# EasyEDA Pro project InOut Counter - Copy (2).eprj

# Schematic MainBoard
Board Name: PCB2; Create Date: 2026-01-17; Page Name: P1; Project Name: InOut Counter - Copy (2); Schematic Name: MainBoard; Update Date: 2026-01-26; Company: EasyEDA.com; Page Size: A4; Version: V1.0
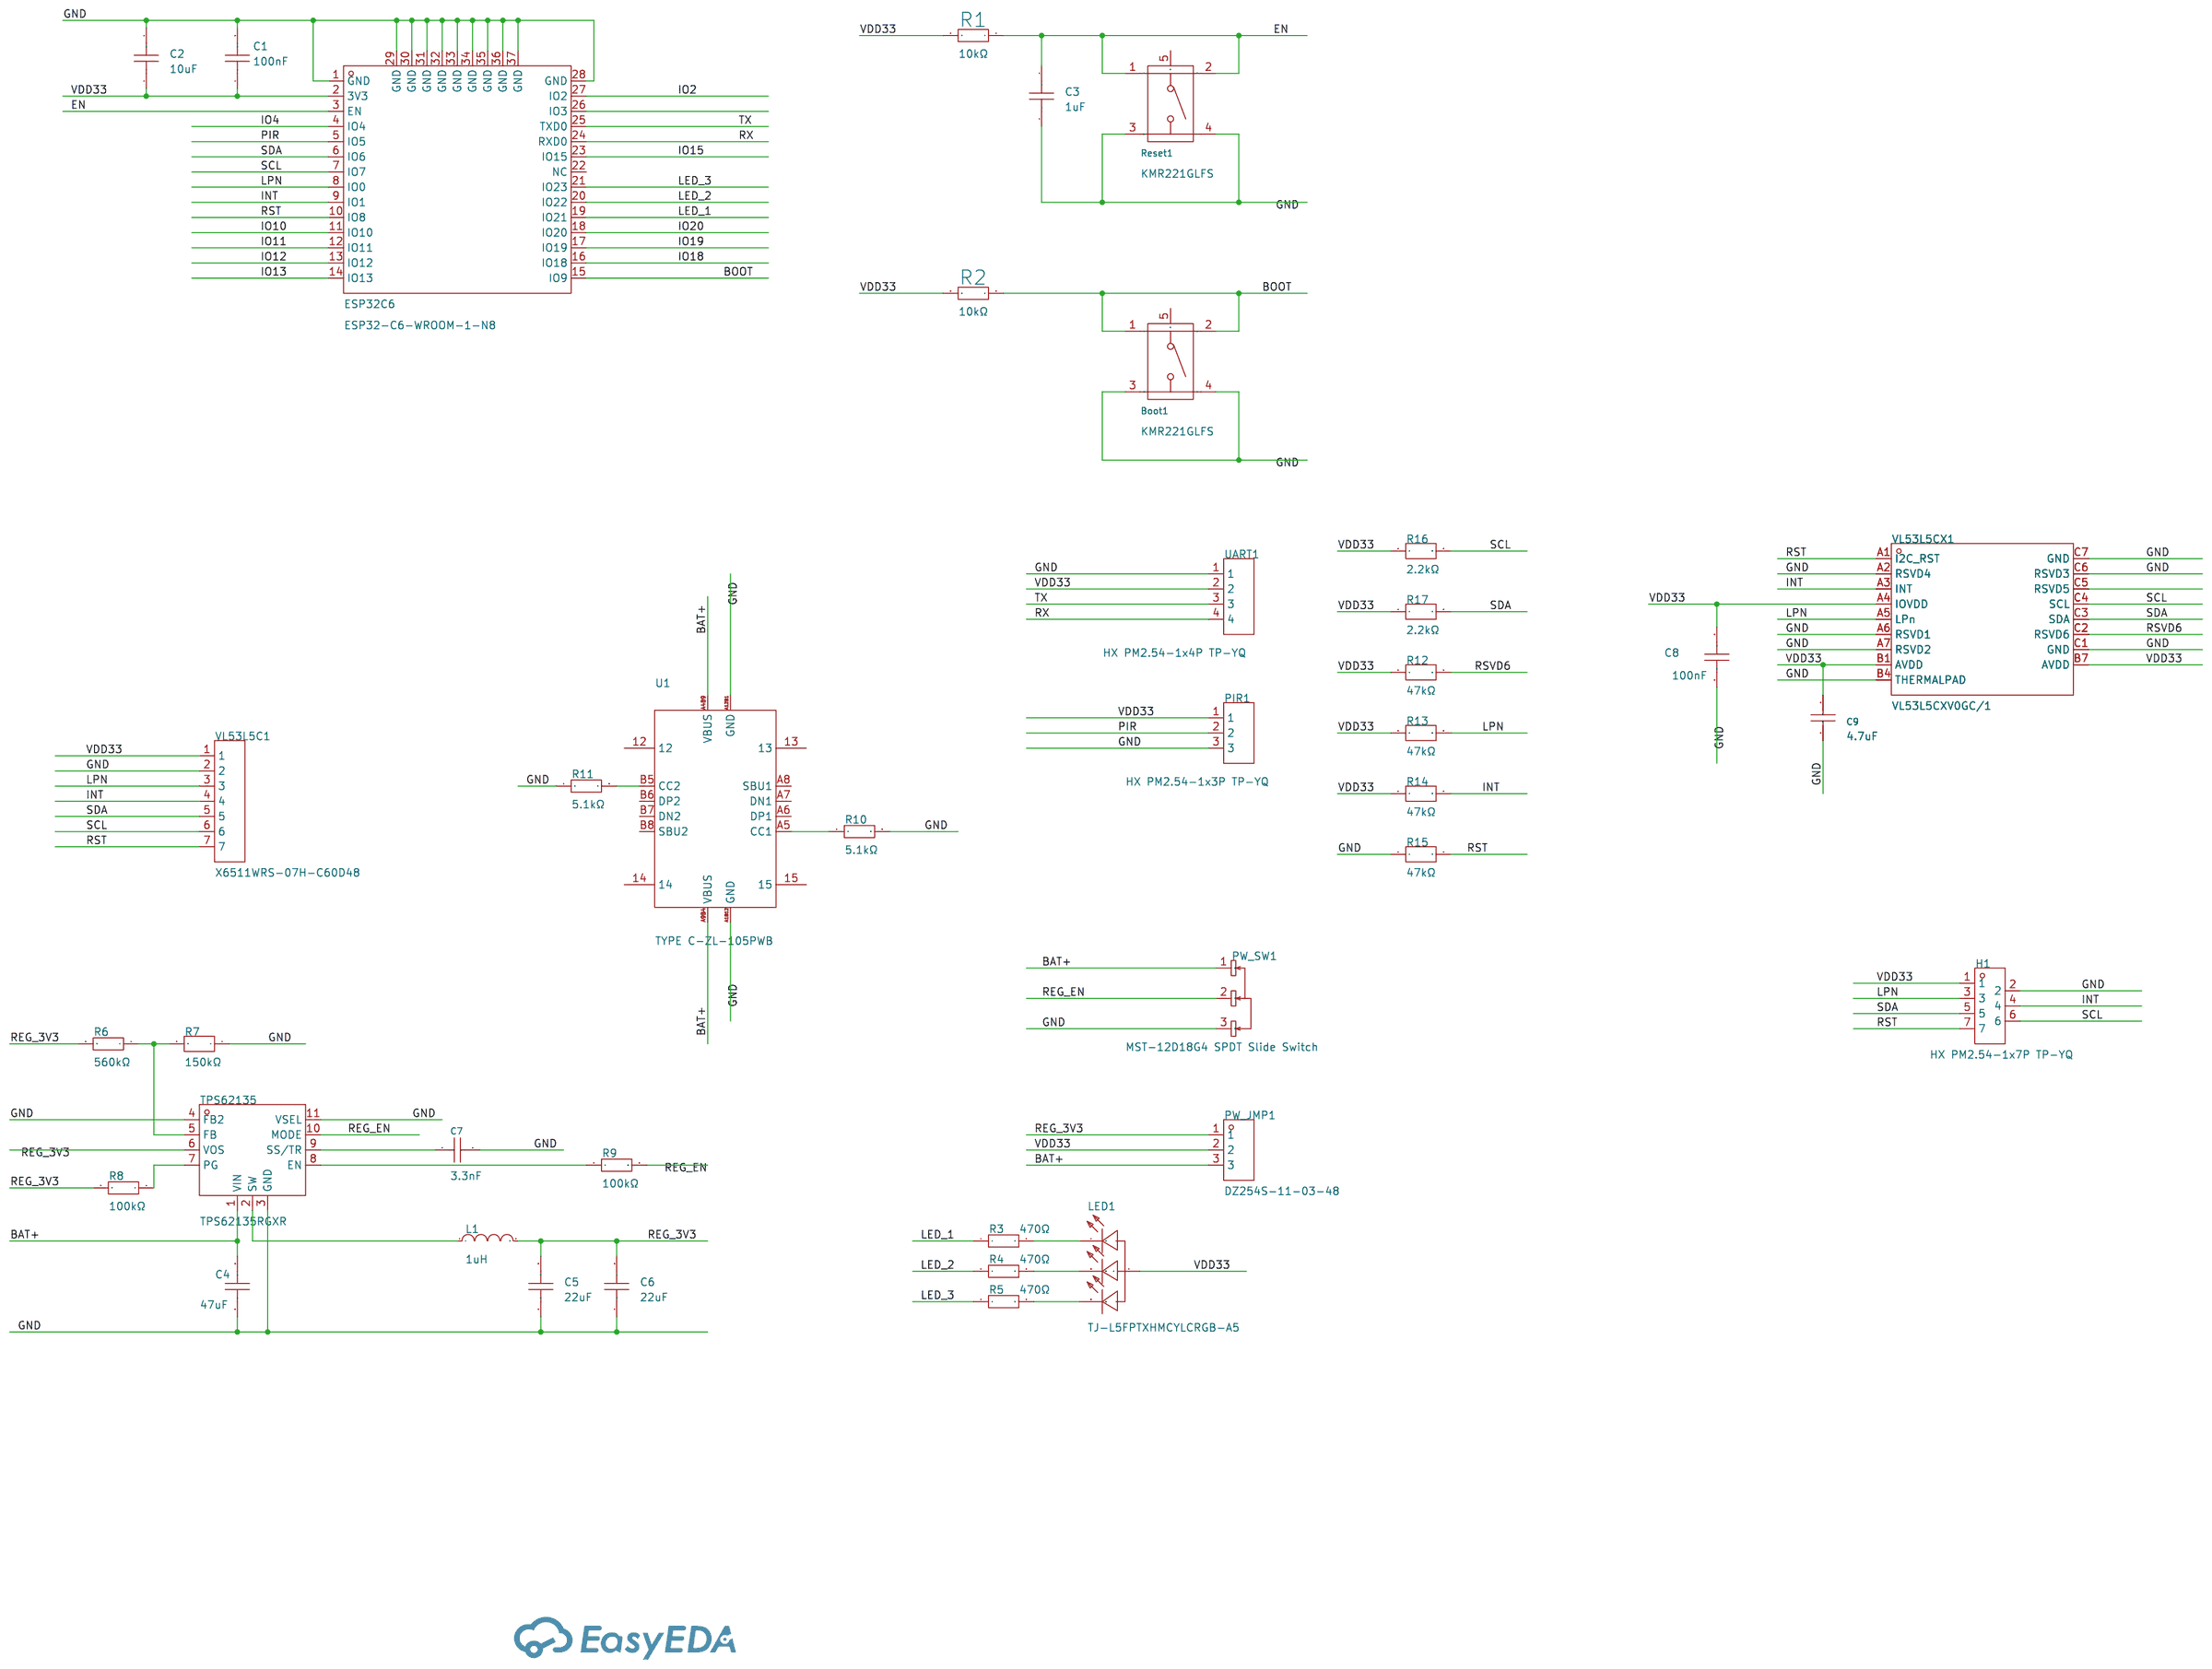
[diagram p0: schematic sheet]

## Parts
Boot1  KMR221GLFS  [KEY-SMD_KMR2XXGXXX]
C1  100nF  [C0603]
C2  10uF  [C0603]
C3  1uF  [C0603]
C4  47uF  [C1206]
C5  22uF  [C0603]
C6  22uF  [C0603]
C7  3.3nF  [C0603]
C8  100nF  [C0603]
C9  4.7uF  [C0603]
ESP32C6  ESP32-C6-WROOM-1-N8  [WIRELM-SMD_ESP32-C6-WROOM-1]
H1  HX PM2.54-1x7P TP-YQ  [HDR-SMD_7P-P2.54_HX-PM2.54-1X7P-TP-YQ]
L1  1uH  [IND-SMD_L2.5-W2.0-VLS252012CX-150M]
LED1  TJ-L5FPTXHMCYLCRGB-A5  [LED-TH_4P-BD5.8-P1.30]
PIR1  HX PM2.54-1x3P TP-YQ  [HDR-SMD_3P-P2.54-V-F_C9900045551]
PW_JMP1  DZ254S-11-03-48  [HDR-TH_3P-P2.54_DZ254S-11-03-48]
PW_SW1  MST-12D18G4 SPDT Slide Switch  [SW-SMD_MST-12D18G4-SPDT-SLIDE-SWITCH]
R1  10kΩ  [R0603]
R2  10kΩ  [R0603]
R3  470Ω  [R0603]
R4  470Ω  [R0603]
R5  470Ω  [R0603]
R6  560kΩ  [R0603]
R7  150kΩ  [R0603]
R8  100kΩ  [R0603]
R9  100kΩ  [R0603]
R10  5.1kΩ  [R0603]
R11  5.1kΩ  [R0603]
R12  47kΩ  [R0603]
R13  47kΩ  [R0603]
R14  47kΩ  [R0603]
R15  47kΩ  [R0603]
R16  2.2kΩ  [R0603]
R17  2.2kΩ  [R0603]
Reset1  KMR221GLFS  [KEY-SMD_KMR2XXGXXX]
TPS62135  TPS62135RGXR  [VQFN-HR-11_L3.0-W2.0-P0.50_TPS62135RGXR]
U1  TYPE C-ZL-105PWB  [TYPE-C-SMD_HDGC_TYPE-C-ZL-105PWB]
UART1  HX PM2.54-1x4P TP-YQ  [HDR-SMD_HX-PM2.54-1X4P-TP-YQ]
VL53L5C1  X6511WRS-07H-C60D48  [HDR-SMD_7P-P2.54-H-M-W13.3-N]
VL53L5CX1  VL53L5CXV0GC/1  [LGA-16_L6.4-W3.0_VL53L5CXV0GC-1]

## Library data of the parts
Boot1 Reset1 = KMR221GLFS: LCSC Part Name: 4.6*2.8*1.9mm 立贴 轻触开关; Supplier Part: C72443; Manufacturer: C&K; Supplier Footprint: SMD; JLCPCB Part Class: Extended Part; Datasheet: https://atta.szlcsc.com/upload/public/pdf/source/20181012/C265019_000848423B8E84768868498C37CC451B.pdf; Supplier: LCSC; Circuit: SPST; Actuator Style: Round Button; Operating Force: 200gf; Mounting Style: Brick nogging; Switch Length: 4.6mm; Switch Width: 2.8mm; Switch Height: 1.9mm; Contact Current: 50mA; Voltage Rating (DC): 32V; Pin Style: Gull Wing; Operating Temperature: -40℃~+85℃
C1 C8 = TCC0603X7R104K500CT: LCSC Part Name: 100nF ±10% 50V; Supplier Part: C282519; Manufacturer: CCTC(三环); Supplier Footprint: 0603; JLCPCB Part Class: Extended Part; Datasheet: https://item.szlcsc.com/datasheet/TCC0603X7R104K500CT/268639.html; Supplier: LCSC; Tolerance: ±10%; Voltage Rating: 50V; Temperature Coefficient: X7R
C2 = CL10A106MQ8NNNC: LCSC Part Name: 10uF ±20% 6.3V; Supplier Part: C1691; Manufacturer: SAMSUNG(三星); Supplier Footprint: 0603; JLCPCB Part Class: Extended Part; Datasheet: https://item.szlcsc.com/datasheet/CL10A106MQ8NNNC/2043.html; Supplier: LCSC; Tolerance: ±20%; Voltage Rating: 6.3V; Temperature Coefficient: X5R
C3 = CGA0603X5R105K500JT: LCSC Part Name: 1uF ±10% 50V; Supplier Part: C6119852; Manufacturer: HRE(芯声); Supplier Footprint: 0603; JLCPCB Part Class: Extended Part; Datasheet: https://item.szlcsc.com/datasheet/CGA0603X5R105K500JT/7062558.html; Supplier: LCSC; Tolerance: ±10%; Voltage Rating: 50V; Temperature Coefficient: X5R
C4 = GRM31CR61E476ME44L: LCSC Part Name: 47uF ±20% 25V; Supplier Part: C403725; Manufacturer: muRata(村田); Supplier Footprint: 1206; JLCPCB Part Class: Extended Part; Datasheet: https://item.szlcsc.com/datasheet/GRM31CR61E476ME44L/389810.html; Supplier: LCSC; Tolerance: ±20%; Voltage Rating: 25V; Temperature Coefficient: X5R
C5 C6 = CL10A226MQ8NRNC: LCSC Part Name: 22uF ±20% 6.3V; Supplier Part: C59461; Manufacturer: SAMSUNG(三星); Supplier Footprint: 0603; JLCPCB Part Class: Basic Part; Datasheet: https://item.szlcsc.com/datasheet/CL10A226MQ8NRNC/60514.html; Supplier: LCSC; Tolerance: ±20%; Voltage Rating: 6.3V; Temperature Coefficient: X5R
C7 = CC0603KRX7R9BB332: LCSC Part Name: 3.3nF ±10% 50V; Supplier Part: C107088; Manufacturer: YAGEO(国巨); Supplier Footprint: 0603; JLCPCB Part Class: Extended Part; Datasheet: https://item.szlcsc.com/datasheet/CC0603KRX7R9BB332/108304.html; Supplier: LCSC; Tolerance: ±10%; Voltage Rating: 50V; Temperature Coefficient: X7R
C9 = CL10A475KP8NNNC: LCSC Part Name: 4.7uF ±10% 10V; Supplier Part: C1705; Manufacturer: SAMSUNG(三星); Supplier Footprint: 0603; JLCPCB Part Class: Extended Part; Datasheet: https://item.szlcsc.com/datasheet/CL10A475KP8NNNC/2057.html; Supplier: LCSC; Tolerance: ±10%; Voltage Rating: 10V; Temperature Coefficient: X5R
ESP32C6 = ESP32-C6-WROOM-1-N8: Supplier Part: C5366877; Manufacturer: ESPRESSIF(乐鑫); JLCPCB Part Class: Extended Part; Datasheet: https://item.szlcsc.com/datasheet/ESP32-C6-WROOM-1-N8/6203223.html; Supplier: LCSC
H1 = HX PM2.54-1x7P TP-YQ: LCSC Part Name: 1x7P 间距:2.54mm 立贴; Supplier Part: C42379199; Manufacturer: hanxia(韩下); Supplier Footprint: SMD,P=2.54mm(交错脚); JLCPCB Part Class: Extended Part; Datasheet: https://item.szlcsc.com/datasheet/HX%2520PM2.54-1x7P%2520TP-YQ/44285228.html; Supplier: LCSC; Holes Structure: 1x7P; Pitch: 2.54mm; Circular Hole / Square Hole: Square Hole; Mounting Type: Surface Mount,Vertical; Number of Rows: 1; Number of Positions: 7P; Current Rating: 3A; Voltage Rating (Max): 1kV; Holes Direction: Top; Insulation Height: 5mm; Contact Material: Brass; Contact Plating: Gold; Operating Temperature: -40℃~+105℃
L1 = VLS252012HBX-1R0M-1: LCSC Part Name: 1uH ±20% 3A; Supplier Part: C360732; Manufacturer: TDK; Supplier Footprint: 1008; JLCPCB Part Class: Extended Part; Datasheet: https://item.szlcsc.com/datasheet/VLS252012HBX-1R0M-1/335519.html; Supplier: LCSC; Tolerance: ±20%; Current Rating: 3A; Current - Saturation(Isat): 3A; DC Resistance(DCR): 47mΩ
LED1 = TJ-L5FPTXHMCYLCRGB-A5: Diode Configuration:Common Anode Wavelength - Dominant:B:460nm~470nm；G:515nm~530nm；R:620nm~630nm Peak Wavelength:R:620nm；G:520nm；B:465nm Luminous Intensity:R:100mcd~200mcd；B:100mcd~200mcd；G:400mcd~600mcd Lens Color:White Frosted Lens Forward Current:20mA; LCSC Part Name: 5MM平头共阳雾状RGB; Supplier Part: C20613339; Manufacturer: TOGIALED(统佳); Supplier Footprint: 插件; JLCPCB Part Class: Extended Part; Datasheet: https://item.szlcsc.com/datasheet/TJ-L5FPTXHMCYLCRGB-A5/21974274.html; Supplier: LCSC; Diode Configuration: Common Anode; Wavelength - Dominant: B:460nm~470nm；G:515nm~530nm；R:620nm~630nm; Peak Wavelength: R:620nm；G:520nm；B:465nm; Luminous Intensity: R:100mcd~200mcd；B:100mcd~200mcd；G:400mcd~600mcd; Lens Color: White Frosted Lens; Forward Current: 20mA; Forward Voltage(Vf): B:2.8V~3.6V；R:1.8V~2.6V；G:2.8V~3.6V; Power(Watts): 184mW; Operating Temperature: -20℃~+80℃; Lamp Holder Type: 5 mm flat-head LED; Pitch: 1.3mm
PIR1 = HX PM2.54-1x3P TP-YQ: LCSC Part Name: 1x3P 间距:2.54mm 立贴; Supplier Part: C42379196; Manufacturer: hanxia(韩下); Supplier Footprint: SMD,P=2.54mm(交错脚); JLCPCB Part Class: Extended Part; Datasheet: https://item.szlcsc.com/datasheet/HX%2520PM2.54-1x3P%2520TP-YQ/44285225.html; Supplier: LCSC; Holes Structure: 1x3P; Pitch: 2.54mm; Circular Hole / Square Hole: Square Hole; Mounting Type: Surface Mount,Vertical; Number of Rows: 1; Number of Positions: 3P; Current Rating: 3A; Voltage Rating (Max): 1kV; Holes Direction: Top; Insulation Height: 5mm; Contact Material: Brass; Contact Plating: Gold; Operating Temperature: -40℃~+105℃
PW_JMP1 = DZ254S-11-03-48: LCSC Part Name: 1x3P 间距:2.54mm 方针 立贴; Supplier Part: C5160786; Manufacturer: DEALON(德艺隆); Supplier Footprint: SMD,P=2.54mm(交错脚); JLCPCB Part Class: Extended Part; Datasheet: https://item.szlcsc.com/datasheet/DZ254S-11-03-48/5807882.html; Supplier: LCSC; Pin Structure: 1x3P; Pitch: 2.54mm; Circluar Pins/Square Pins: Pin Header; Mounting Type: Surface Mount,Vertical; Number of Rows: 1; Number of Pins: 3P; Current Rating: 3A; Length of Mating Pin: 6mm; Insulation Height: 2.54mm; Contact Material: Brass; Contact Plating: Gold; Color: Black
PW_SW1 = MST-12D18G4 SPDT Slide Switch: LCSC Part Name: MST-12D18G4卧式带柱编带; Supplier Part: C49023767; Manufacturer: SHOU HAN(首韩); Supplier Footprint: SMD; JLCPCB Part Class: Extended Part; Datasheet: https://item.szlcsc.com/datasheet/MST-12D18G4%2520SPDT%2520Slide%2520Switch/51384142.html; Supplier: LCSC; Circuit: SPDT; Actuator Style: Rectangular Columnar; Termination Style: SMD(SMT) Tab; Length: 9.1mm; Width: 3.5mm; Switch Height: 7.5mm; Mounting Type: Surface Mount, Right Angle; Actuator Color: Black; Current Rating: 100mA; Voltage Rating: 12V; Life: 10,000 Cycles; Operating Temperature: -25℃~+70℃
R1 R2 = 0603WAF1002T5E: LCSC Part Name: 厚膜电阻 10kΩ ±1% 100mW; Supplier Part: C25804; Manufacturer: UNI-ROYAL(厚声); Supplier Footprint: 0603; JLCPCB Part Class: Basic Part; Datasheet: https://item.szlcsc.com/datasheet/0603WAF1002T5E/26547.html; Supplier: LCSC; Type: Thick Film Resistor; Tolerance: ±1%; Power(Watts): 100mW; Voltage-Supply(Max): 75V; Temperature Coefficient: ±100ppm/℃; Operating Temperature: -55℃~+155℃
R3-R5 = 0603WAF4700T5E: LCSC Part Name: 470Ω ±1% 100mW 厚膜电阻; Supplier Part: C23179; Manufacturer: UNI-ROYAL(厚声); Supplier Footprint: 0603; JLCPCB Part Class: Basic Part; Datasheet: https://item.szlcsc.com/datasheet/0603WAF4700T5E/23906.html; Supplier: LCSC; Type: Thick Film Resistor; Tolerance: ±1%; Power(Watts): 100mW; Voltage-Supply(Max): 75V; Temperature Coefficient: ±100ppm/℃; Operating Temperature: -55℃~+155℃
R6 = 0603WAF5603T5E: LCSC Part Name: 560kΩ ±1% 100mW 厚膜电阻; Supplier Part: C23203; Manufacturer: UNI-ROYAL(厚声); Supplier Footprint: 0603; JLCPCB Part Class: Extended Part; Datasheet: https://item.szlcsc.com/datasheet/0603WAF5603T5E/23930.html; Supplier: LCSC; Type: Thick Film Resistor; Tolerance: ±1%; Power(Watts): 100mW; Voltage-Supply(Max): 75V; Temperature Coefficient: ±100ppm/℃; Operating Temperature: -55℃~+155℃
R7 = FRC0603F1503TS: LCSC Part Name: 150kΩ ±1% 100mW 厚膜电阻; Supplier Part: C2906993; Manufacturer: FOJAN(富捷); Supplier Footprint: 0603; JLCPCB Part Class: Extended Part; Supplier: LCSC; Type: Thick Film Resistor; Tolerance: ±1%; Power(Watts): 100mW; Voltage-Supply(Max): 75V; Temperature Coefficient: ±100ppm/℃; Operating Temperature: -55℃~+155℃
R8 R9 = 0603WAF1003T5E: LCSC Part Name: 100kΩ ±1% 100mW 厚膜电阻; Supplier Part: C25803; Manufacturer: UNI-ROYAL(厚声); Supplier Footprint: 0603; JLCPCB Part Class: Basic Part; Datasheet: https://item.szlcsc.com/datasheet/0603WAF1003T5E/26546.html; Supplier: LCSC; Type: Thick Film Resistor; Tolerance: ±1%; Power(Watts): 100mW; Voltage-Supply(Max): 75V; Temperature Coefficient: ±100ppm/℃; Operating Temperature: -55℃~+155℃
R10 R11 = 0603WAF5101T5E: Type:Thick Film Resistor Resistance:5.1kΩ Tolerance:±1% Tolerance:±1% Power(Watts):100mW Voltage-Supply(Max):75V Temperature Coefficient:±100ppm/℃ Temperature Coefficient:±100ppm/℃ Operating Temperature:-55℃~+155℃ Operating Temperature:-55℃~+155℃; LCSC Part Name: 5.1kΩ ±1% 100mW 厚膜电阻; Supplier Part: C23186; Manufacturer: UNI-ROYAL(厚声); Supplier Footprint: 0603; JLCPCB Part Class: Basic Part; Datasheet: https://item.szlcsc.com/datasheet/0603WAF5101T5E/23913.html; Supplier: LCSC; Type: Thick Film Resistor; Tolerance: ±1%; Power(Watts): 100mW; Voltage-Supply(Max): 75V; Temperature Coefficient: ±100ppm/℃; Operating Temperature: -55℃~+155℃
R12-R15 = FRC0603F4702TS: LCSC Part Name: 47kΩ ±1% 100mW 厚膜电阻; Supplier Part: C2907042; Manufacturer: FOJAN(富捷); Supplier Footprint: 0603; JLCPCB Part Class: Extended Part; Supplier: LCSC; Type: Thick Film Resistor; Tolerance: ±1%; Power(Watts): 100mW; Voltage-Supply(Max): 75V; Temperature Coefficient: ±100ppm/℃; Operating Temperature: -55℃~+155℃
R16 R17 = FRC0603J222 TS: LCSC Part Name: 2.2kΩ ±5% 100mW 厚膜电阻; Supplier Part: C2907117; Manufacturer: FOJAN(富捷); Supplier Footprint: 0603; JLCPCB Part Class: Extended Part; Supplier: LCSC; Type: Thick Film Resistor; Tolerance: ±5%; Power(Watts): 100mW; Voltage-Supply(Max): 75V; Temperature Coefficient: ±100ppm/℃; Operating Temperature: -55℃~+155℃
TPS62135 = TPS62135RGXR: LCSC Part Name: 高精度3V至17V 4A降压转换器; Supplier Part: C167238; Manufacturer: TI(德州仪器); Supplier Footprint: VQFN-11-HR(2x3); JLCPCB Part Class: Extended Part; Datasheet: https://www.ti.com/cn/lit/gpn/tps62135; Supplier: LCSC; Function: Step-down type; Output Type: Adjustable; Input Voltage: 3V~17V; Output Voltage: 800mV~12V; Output Current: 4A; Switching Frequency: 2.5MHz; Operating Temperature: -40℃~+125℃; Synchronous Rectification: Yes; Number of Outputs: 1; Topology: Step-down; Quiescent Current (Iq): 18uA; Switch tube (built-in/external): Built-in
U1 = TYPE C-ZL-105PWB: Connector Type:Type-C Gender:Female Mounting Type:Surface Mount, Right Angle Number of Contacts:16P Number of Ports:1 Connect-Disconnect Life:10,000 cycles Length:7.35mm; LCSC Part Name: Type-C 母 卧贴; Supplier Part: C5273953; Manufacturer: HDGC(华德共创); Supplier Footprint: SMD; JLCPCB Part Class: Extended Part; Datasheet: https://item.szlcsc.com/datasheet/TYPE%2520C-ZL-105PWB/6003804.html; Supplier: LCSC; Connector Type: Type-C; Gender: Female; Mounting Type: Surface Mount, Right Angle; Number of Contacts: 16P; Number of Ports: 1; Connect-Disconnect Life: 10,000 cycles; Length: 7.35mm
UART1 = HX PM2.54-1x4P TP-YQ: LCSC Part Name: 1x4P 间距:2.54mm 立贴; Supplier Part: C42379197; Manufacturer: hanxia(韩下); Supplier Footprint: SMD,P=2.54mm(交错脚); JLCPCB Part Class: Extended Part; Datasheet: https://item.szlcsc.com/datasheet/HX%2520PM2.54-1x4P%2520TP-YQ/44285226.html; Supplier: LCSC; Holes Structure: 1x4P; Pitch: 2.54mm; Circular Hole / Square Hole: Square Hole; Mounting Type: Surface Mount,Vertical; Number of Rows: 1; Number of Positions: 4P; Current Rating: 3A; Voltage Rating (Max): 1kV; Holes Direction: Top; Insulation Height: 5mm; Contact Material: Brass; Contact Plating: Gold; Operating Temperature: -40℃~+105℃
VL53L5C1 = X6511WRS-07H-C60D48: LCSC Part Name: 1x7P 间距:2.54mm 方针; Supplier Part: C5242200; Manufacturer: XKB Connection(中国星坤); Supplier Footprint: SMD,P=2.54mm; JLCPCB Part Class: Extended Part; Datasheet: https://atta.szlcsc.com/upload/public/pdf/source/20221103/EADF72CF36CD96D511D8188ACEE72315.pdf; Supplier: LCSC; Pin Structure: 1x7P; Pitch: 2.54mm; Row Spacing: 2.54mm; Circluar Pins/Square Pins: Policy; Number of Rows: Single Row; Number of Pins: 7P; Current Rating: 3A; Voltage Rating (Max): 250V; Insulation Height: 2.5mm; Contact Material: Brass; Contact Plating: Gold; Operating Temperature: -40℃~+105℃; Color: Black
VL53L5CX1 = VL53L5CXV0GC/1: LCSC Part Name: I2C接口的飞行时间多区测距传感器; Supplier Part: C3178303; Manufacturer: ST(意法半导体); Supplier Footprint: SMD,6.4x3mm; JLCPCB Part Class: Extended Part; Datasheet: https://item.szlcsc.com/datasheet/VL53L5CXV0GC%252F1/3740241.html; Supplier: LCSC; Voltage - Supply: 2.8V~3.3V; Linear Range: 4m

## Nets
GND: Boot1.3 Boot1.4 C1.2 C2.2 C3.1 C4.1 C5.1 C6.1 C7.2 C8.1 C9.1 ESP32C6.1(GND) ESP32C6.28(GND) ESP32C6.29(GND) ESP32C6.30(GND) ESP32C6.31(GND) ESP32C6.32(GND) ESP32C6.33(GND) ESP32C6.34(GND) ESP32C6.35(GND) ESP32C6.36(GND) ESP32C6.37(GND) H1.2 PIR1.3 PW_SW1.3 R7.1 R10.2 R11.1 R15.1 Reset1.3 Reset1.4 TPS62135.3(GND) TPS62135.4(FB2) TPS62135.11(VSEL) U1.A1B12(GND) U1.A12B1(GND) UART1.1 VL53L5C1.2 VL53L5CX1.A2(RSVD4) VL53L5CX1.A6(RSVD1) VL53L5CX1.A7(RSVD2) VL53L5CX1.B4(THERMALPAD) VL53L5CX1.C1(GND) VL53L5CX1.C6(RSVD3) VL53L5CX1.C7(GND)
VDD33: C1.1 C2.1 C8.2 C9.2 ESP32C6.2(3V3) H1.1 LED1.1 PIR1.1 PW_JMP1.2 R1.2 R2.2 R12.1 R13.1 R14.1 R16.1 R17.1 UART1.2 VL53L5C1.1 VL53L5CX1.A4(IOVDD) VL53L5CX1.B1(AVDD) VL53L5CX1.B7(AVDD)
BAT+: C4.2 PW_JMP1.3 PW_SW1.1 TPS62135.1(VIN) U1.A4B9(VBUS) U1.A9B4(VBUS)
BOOT: Boot1.1 Boot1.2 ESP32C6.15(IO9) R2.1
EN: C3.2 ESP32C6.3(EN) R1.1 Reset1.1 Reset1.2
INT: ESP32C6.9(IO1) H1.4 R14.2 VL53L5C1.4 VL53L5CX1.A3(INT)
IO2: ESP32C6.27(IO2)
IO4: ESP32C6.4(IO4)
IO10: ESP32C6.11(IO10)
IO11: ESP32C6.12(IO11)
IO12: ESP32C6.13(IO12)
IO13: ESP32C6.14(IO13)
IO15: ESP32C6.23(IO15)
IO18: ESP32C6.16(IO18)
IO19: ESP32C6.17(IO19)
IO20: ESP32C6.18(IO20)
LED_1: ESP32C6.19(IO21) R3.1
LED_2: ESP32C6.20(IO22) R4.1
LED_3: ESP32C6.21(IO23) R5.1
LPN: ESP32C6.8(IO0) H1.3 R13.2 VL53L5C1.3 VL53L5CX1.A5(LPn)
PIR: ESP32C6.5(IO5) PIR1.2
REG_3V3: C5.2 C6.2 L1.2 PW_JMP1.1 R6.2 R8.2 TPS62135.6(VOS)
REG_EN: PW_SW1.2 R9.2 TPS62135.10(MODE)
RST: ESP32C6.10(IO8) H1.7 R15.2 VL53L5C1.7 VL53L5CX1.A1(I2C_RST)
RSVD6: R12.2 VL53L5CX1.C2(RSVD6)
RX: ESP32C6.24(RXD0) UART1.4
SCL: ESP32C6.7(IO7) H1.6 R16.2 VL53L5C1.6 VL53L5CX1.C4(SCL)
SDA: ESP32C6.6(IO6) H1.5 R17.2 VL53L5C1.5 VL53L5CX1.C3(SDA)
TX: ESP32C6.25(TXD0) UART1.3
$1N15941: L1.1 TPS62135.2(SW)
$1N15942: R8.1 TPS62135.7(PG)
$1N15949: R9.1 TPS62135.8(EN)
$1N15952: R6.1 R7.2 TPS62135.5(FB)
$1N15959: C7.1 TPS62135.9(SS/TR)
$1N15996: LED1.4(R) R3.2
$1N15997: LED1.3(G) R4.2
$1N15998: LED1.2(B) R5.2
$1N16060: R10.1 U1.A5(CC1)
$1N16063: R11.2 U1.B5(CC2)

Not connected (* = marked no-connect by the designer): Boot1 5; ESP32C6 22(NC) 26(IO3); Reset1 5; U1 12 13 14 15 A6(DP1) A7(DN1) A8(SBU1) B6(DP2) B7(DN2) B8(SBU2); VL53L5CX1 C5(RSVD5)

# Schematic DaughterBoard
Board Name: Board1; Create Date: 2026-01-23; Page Name: P1; Project Name: InOut Counter; Schematic Name: DaughterBoard; Update Date: 2026-01-23; Company: EasyEDA.com; Page Size: A4; Version: V1.0
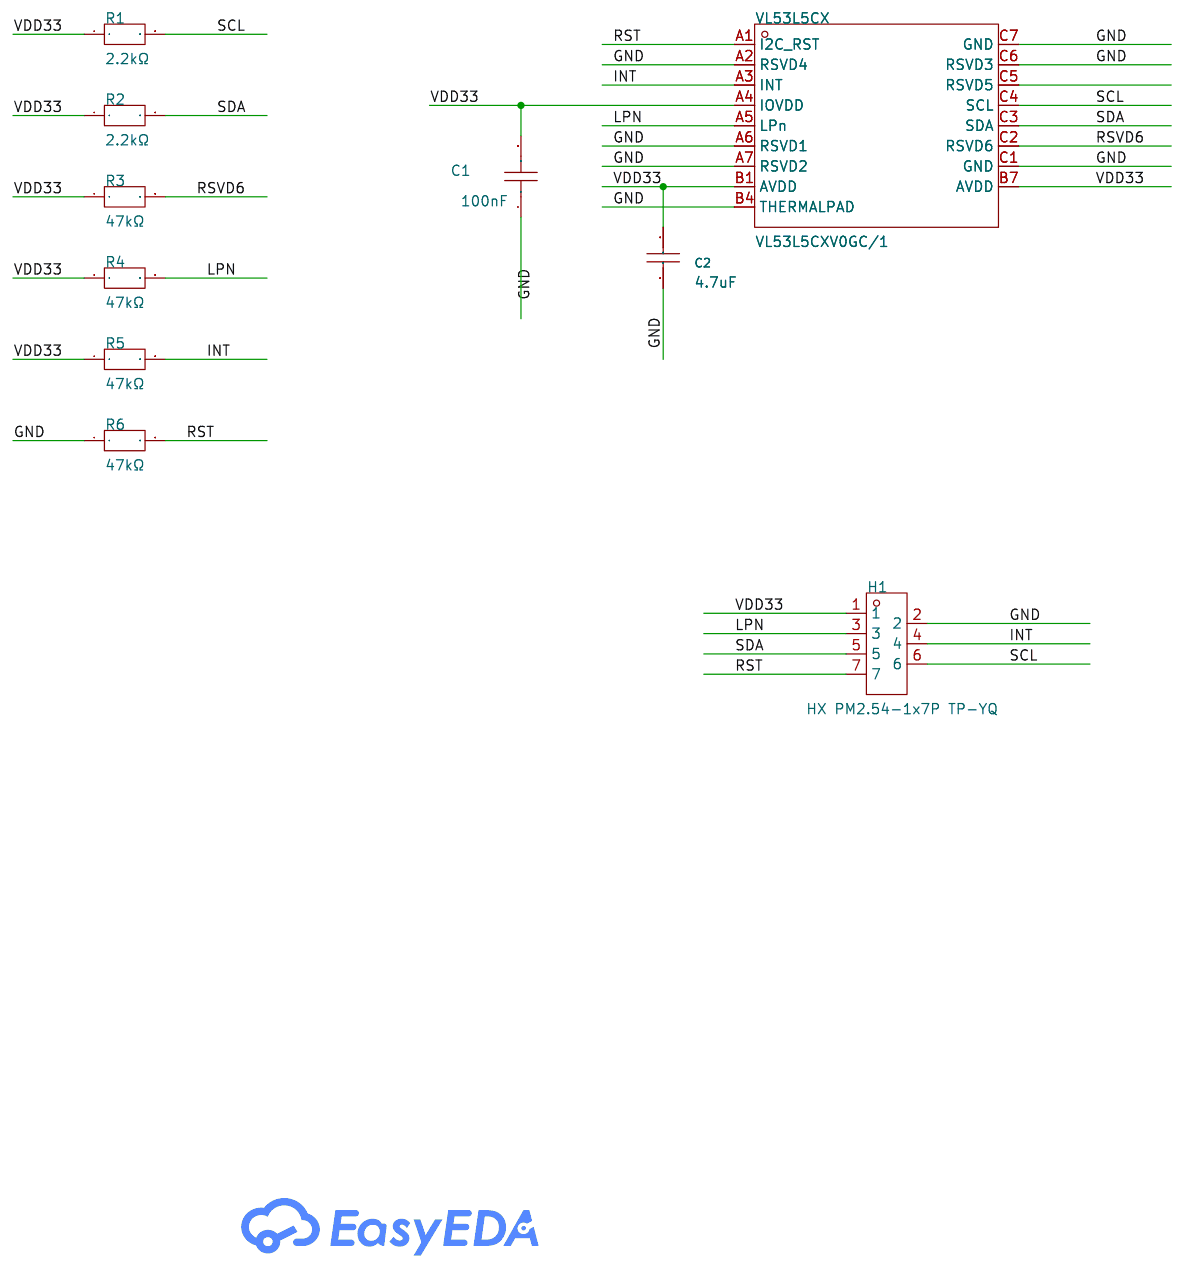
[diagram p1: schematic sheet]

## Parts
C1  100nF  [C0603]
C2  4.7uF  [C0603]
H1  HX PM2.54-1x7P TP-YQ  [HDR-SMD_7P-P2.54_HX-PM2.54-1X7P-TP-YQ]
R1  2.2kΩ  [R0603]
R2  2.2kΩ  [R0603]
R3  47kΩ  [R0603]
R4  47kΩ  [R0603]
R5  47kΩ  [R0603]
R6  47kΩ  [R0603]
VL53L5CX  VL53L5CXV0GC/1  [LGA-16_L6.4-W3.0_VL53L5CXV0GC-1]

## Library data of the parts
C1 = TCC0603X7R104K500CT: LCSC Part Name: 100nF ±10% 50V; Supplier Part: C282519; Manufacturer: CCTC(三环); Supplier Footprint: 0603; JLCPCB Part Class: Extended Part; Datasheet: https://item.szlcsc.com/datasheet/TCC0603X7R104K500CT/268639.html; Supplier: LCSC; Tolerance: ±10%; Voltage Rating: 50V; Temperature Coefficient: X7R
C2 = CL10A475KP8NNNC: LCSC Part Name: 4.7uF ±10% 10V; Supplier Part: C1705; Manufacturer: SAMSUNG(三星); Supplier Footprint: 0603; JLCPCB Part Class: Extended Part; Datasheet: https://item.szlcsc.com/datasheet/CL10A475KP8NNNC/2057.html; Supplier: LCSC; Tolerance: ±10%; Voltage Rating: 10V; Temperature Coefficient: X5R
H1 = HX PM2.54-1x7P TP-YQ: LCSC Part Name: 1x7P 间距:2.54mm 立贴; Supplier Part: C42379199; Manufacturer: hanxia(韩下); Supplier Footprint: SMD,P=2.54mm(交错脚); JLCPCB Part Class: Extended Part; Datasheet: https://item.szlcsc.com/datasheet/HX%2520PM2.54-1x7P%2520TP-YQ/44285228.html; Supplier: LCSC; Holes Structure: 1x7P; Pitch: 2.54mm; Circular Hole / Square Hole: Square Hole; Mounting Type: Surface Mount,Vertical; Number of Rows: 1; Number of Positions: 7P; Current Rating: 3A; Voltage Rating (Max): 1kV; Holes Direction: Top; Insulation Height: 5mm; Contact Material: Brass; Contact Plating: Gold; Operating Temperature: -40℃~+105℃
R1 R2 = FRC0603J222 TS: LCSC Part Name: 2.2kΩ ±5% 100mW 厚膜电阻; Supplier Part: C2907117; Manufacturer: FOJAN(富捷); Supplier Footprint: 0603; JLCPCB Part Class: Extended Part; Supplier: LCSC; Type: Thick Film Resistor; Tolerance: ±5%; Power(Watts): 100mW; Voltage-Supply(Max): 75V; Temperature Coefficient: ±100ppm/℃; Operating Temperature: -55℃~+155℃
R3-R6 = FRC0603F4702TS: LCSC Part Name: 47kΩ ±1% 100mW 厚膜电阻; Supplier Part: C2907042; Manufacturer: FOJAN(富捷); Supplier Footprint: 0603; JLCPCB Part Class: Extended Part; Supplier: LCSC; Type: Thick Film Resistor; Tolerance: ±1%; Power(Watts): 100mW; Voltage-Supply(Max): 75V; Temperature Coefficient: ±100ppm/℃; Operating Temperature: -55℃~+155℃
VL53L5CX = VL53L5CXV0GC/1: LCSC Part Name: I2C接口的飞行时间多区测距传感器; Supplier Part: C3178303; Manufacturer: ST(意法半导体); Supplier Footprint: SMD,6.4x3mm; JLCPCB Part Class: Extended Part; Datasheet: https://item.szlcsc.com/datasheet/VL53L5CXV0GC%252F1/3740241.html; Supplier: LCSC; Voltage - Supply: 2.8V~3.3V; Linear Range: 4m

## Nets
GND: C1.1 C2.1 H1.2 R6.1 VL53L5CX.A2(RSVD4) VL53L5CX.A6(RSVD1) VL53L5CX.A7(RSVD2) VL53L5CX.B4(THERMALPAD) VL53L5CX.C1(GND) VL53L5CX.C6(RSVD3) VL53L5CX.C7(GND)
VDD33: C1.2 C2.2 H1.1 R1.1 R2.1 R3.1 R4.1 R5.1 VL53L5CX.A4(IOVDD) VL53L5CX.B1(AVDD) VL53L5CX.B7(AVDD)
INT: H1.4 R5.2 VL53L5CX.A3(INT)
LPN: H1.3 R4.2 VL53L5CX.A5(LPn)
RST: H1.7 R6.2 VL53L5CX.A1(I2C_RST)
RSVD6: R3.2 VL53L5CX.C2(RSVD6)
SCL: H1.6 R1.2 VL53L5CX.C4(SCL)
SDA: H1.5 R2.2 VL53L5CX.C3(SDA)

Not connected (* = marked no-connect by the designer): VL53L5CX C5(RSVD5)

# Board PCB1
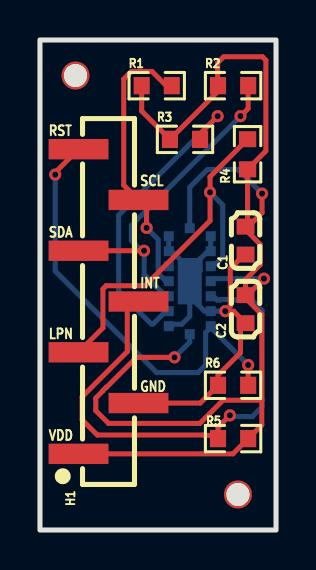
[diagram p2: board, top side]
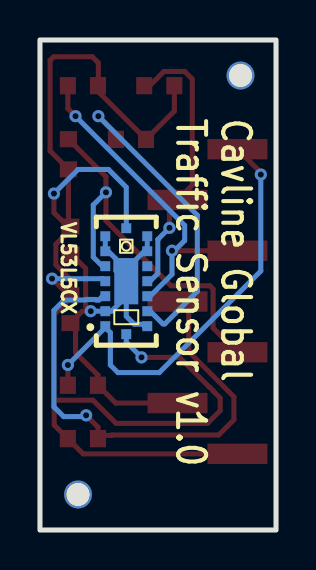
[diagram p3: board, bottom side, seen from below]

Outline 11.81 x 24.51 mm; copper layers: Top Layer, Bottom Layer. Coordinates in mm from the lower left corner of the outline.
Outline path: rectangle 0,24.51 11.81,0
Stack: Top Layer 0.035mm / Dielectric1 1.51mm FR4 er 4.5 / Bottom Layer 0.035mm

## Design rules (mm)
template: JLCPCB Capability(Two Layers Board)
spacing copperThickness1oz (default): track to track 0.102, other pairs 0.152 to 0.3
spacing copperThickness2oz: track to track 0.203, other pairs 0.152 to 0.3
track width copperThickness1oz (default): min 0.127, default 0.254, max 2.54
track width copperThickness2oz: min 0.203, default 0.254, max 2.54
differential pair differentialPair (default): width min 0.127, default 0.254, max 2.54; gap min 0.152, default 0.152
via viaSize (default): diameter min 0.5, default 0.61, max 10; hole min 0.3, default 0.305, max 6.3

## Placement (name value [footprint] x y rotation side)
C1  100nF  [C0603]  10.29 14.48 90 top
C2  4.7uF  [C0603]  10.29 11.05 90 top
H1  HX PM2.54-1x7P TP-YQ  [HDR-SMD_7P-P2.54_HX-PM2.54-1X7P-TP-YQ]  3.43 11.43 90 top
NOREF  -  [Pad_e0]  1.78 22.73 0 top
NOREF#2  -  [Pad_e10]  9.91 1.78 0 top
R1  2.2kΩ  [R0603]  5.84 22.22 0 top
R2  2.2kΩ  [R0603]  9.66 22.22 0 top
R3  47kΩ  [R0603]  7.26 19.54 0 top
R4  47kΩ  [R0603]  10.39 18.8 90 top
R5  47kΩ  [R0603]  9.66 4.57 180 top
R6  47kΩ  [R0603]  9.66 7.24 0 top
VL53L5CX  VL53L5CXV0GC/1  [LGA-16_L6.4-W3.0_VL53L5CXV0GC-1]  7.49 12.45 270 bottom

## Footprints (pads in the part's own frame, mm; a bottom-side part is the same pattern mirrored in y, then rotated)
C0603
  rect 0.8x0.9 smd: 1(-0.7,0) 2(0.7,0)
HDR-SMD_7P-P2.54_HX-PM2.54-1X7P-TP-YQ
  rect 1.02x3 smd: 1(-7.62,1.5) 2(-5.08,-1.5) 3(-2.54,1.5) 4(0,-1.5) 5(2.54,1.5) 6(5.08,-1.5) 7(7.62,1.5)
LGA-16_L6.4-W3.0_VL53L5CXV0GC-1
  rect 0.5x0.5 smd: A1(2.25,-1.05) A2(1.5,-1.05) A3(0.75,-1.05) A4(0,-1.05) A5(-0.75,-1.05) A6(-1.5,-1.05) A7(-2.25,-1.05) B1(2.65,0) B7(-2.65,0) C1(2.25,1.05) C2(1.5,1.05) C3(0.75,1.05) C4(0,1.05) C5(-0.75,1.05) C6(-1.5,1.05) C7(-2.25,1.05)
  rect 2.316x1.2 smd: B4(0,0)
Pad_e0
  round 1.4 hole 1.152: 1(0,0)
Pad_e10
  round 1.4 hole 1.152: 2(0,0)
R0603
  rect 0.806x0.864 smd: 1(-0.753,0) 2(0.753,0)

## Nets
As in the schematic.

Pads without a net: NOREF 1; NOREF#2 2

## Via types
v1: diameter 0.61, hole 0.305, Top Layer to Bottom Layer, 12 vias

## Routing (per net, layer and track width the routed paths; a pad name or vN(x,y) marks a point on that pad's centre or on a via; arc(x,y) is an arc through that point)
GND: length 23.2
  Top Layer w0.254: H1.2 8.02,6.35 8.91,7.24 8.91,7.75 10.03,8.87 10.03,10.09 C2.1 9.69,10.95 v1(9.27,10.95) 9.53,11.2 9.53,13.08 10.22,13.78 C1.1
  Bottom Layer w0.254: v1(9.27,10.95) VL53L5CX.A2 8.23,10.95 7.49,11.68 ; 7.49,11.68 7.49,10.69 7.09,10.29 6.66,10.29 6.57,10.2 6.44,10.2 ; 7.49,11.68 VL53L5CX.B4 ; 6.44,14.7 6.44,13.95 6.59,13.95 7.24,13.3 7.24,13.15 7.49,12.9 VL53L5CX.B4 ; VL53L5CX.B4 8.01,12.97 8.01,13.56 8.4,13.95 VL53L5CX.A6 VL53L5CX.A7
VDD33: length 68.6
  Top Layer w0.254: C2.2 10.29,12.53 11.02,13.26 11.02,14.29 10.29,15.02 C1.2 ; C2.2 10.29,11.59 11.1,10.78 11.1,6.49 ; C2.2 10.38,11.75 v1(11.21,12.57) ; v1(11.11,16.83) 11.11,15.88 10.42,15.18 C1.2 ; v1(6.73,8.64) 4.83,8.64 3.33,7.14 3.31,7.14 3.15,6.98 3.15,6.96 2.79,6.6 2.79,5.97 3.43,5.33 8,5.33 9.16,6.49 11.1,6.49 ; C1.2 10.39,15.28 R4.1 11.3,18.96 11.3,23.49 11.12,23.67 9.2,23.67 8.89,23.37 8.89,22.24 8.91,22.22 8.91,21.95 R3.1 5.09,20.95 R1.1 ; 11.1,6.49 11.1,5.25 R5.1 9.65,3.81 1.93,3.81
  Bottom Layer w0.254: 7.49,15.1 7.49,17.14 8.38,18.03 9.91,18.03 v1(11.11,16.83) ; v1(6.73,8.64) 7.49,9.4 VL53L5CX.B1 ; v1(11.21,12.57) 8.67,12.57 VL53L5CX.A4
INT: length 25.3
  Top Layer w0.254: 8.91,4.81 8.66,4.81 8.58,4.73 8.22,4.73 8.2,4.75 2.87,4.75 2.11,5.51 2.11,6.66 4.37,8.92 4.37,11.1 4.7,11.43 H1.4 ; 8.91,4.81 8.91,5.14 v1(9.5,5.74) ; 8.91,4.81 8.91,4.57
  Bottom Layer w0.254: v1(9.5,5.74) 9.57,5.67 10.63,5.67 11.11,6.16 11.11,10.99 10.59,11.51 9.54,11.51 9.51,11.53 9.03,11.53 9,11.51 8.86,11.51 8.73,11.63 8.61,11.63 VL53L5CX.A3
LPN: length 19.6
  Top Layer w0.254: R4.2 8.51,17.67 v1(8.51,16.89) 8.51,15.47 5.26,12.22 3.31,12.22 3.15,12.06 3.15,10.11 1.93,8.89
  Bottom Layer w0.254: v1(8.51,16.89) 9.14,16.26 9.14,13.65 8.69,13.2 VL53L5CX.A5
RST: length 22.1
  Top Layer w0.254: v1(0.76,17.78) 0.76,17.88 H1.7 ; R6.2 v1(10.42,8.25)
  Bottom Layer w0.254: v1(10.42,8.25) 8.54,10.13 ; 8.54,10.13 VL53L5CX.A1 ; 8.54,10.13 8.29,9.87 8.29,8.25 7.91,7.87 5.84,7.87 0.76,12.95 v1(0.76,17.78)
RSVD6: length 15.8
  Top Layer w0.254: v1(8.89,20.7) 8.01,19.82 R3.2
  Bottom Layer w0.254: 6.44,10.95 6.3,10.95 5.66,10.31 5.56,10.31 3.94,11.94 3.94,15.75 v1(8.89,20.7)
SCL: length 14
  Top Layer w0.254: R1.2 6.32,22.22 5.61,22.94 4.57,22.94 4.19,22.56 4.19,17.25 H1.6 5.33,16.1 v1(5.33,15.11)
  Bottom Layer w0.254: v1(5.33,15.11) 5.91,14.53 5.91,12.83 6.3,12.45 6.44,12.45
SDA: length 17.2
  Top Layer w0.254: R2.2 10.42,21.08 v1(10.03,20.7) ; H1.5 v1(5.21,13.97)
  Bottom Layer w0.254: 6.44,11.7 6.3,11.7 5.21,12.79 v1(5.21,13.97) 5.08,13.97 4.57,14.48 4.57,15.24 v1(10.03,20.7)

## Text on the board
Bottom Silkscreen Layer: Cavline Global / Traffic Sensor v1.0
Top Silkscreen Layer: RST | SDA | LPN | VDD | SCL | INT | GND

# Board PCB2
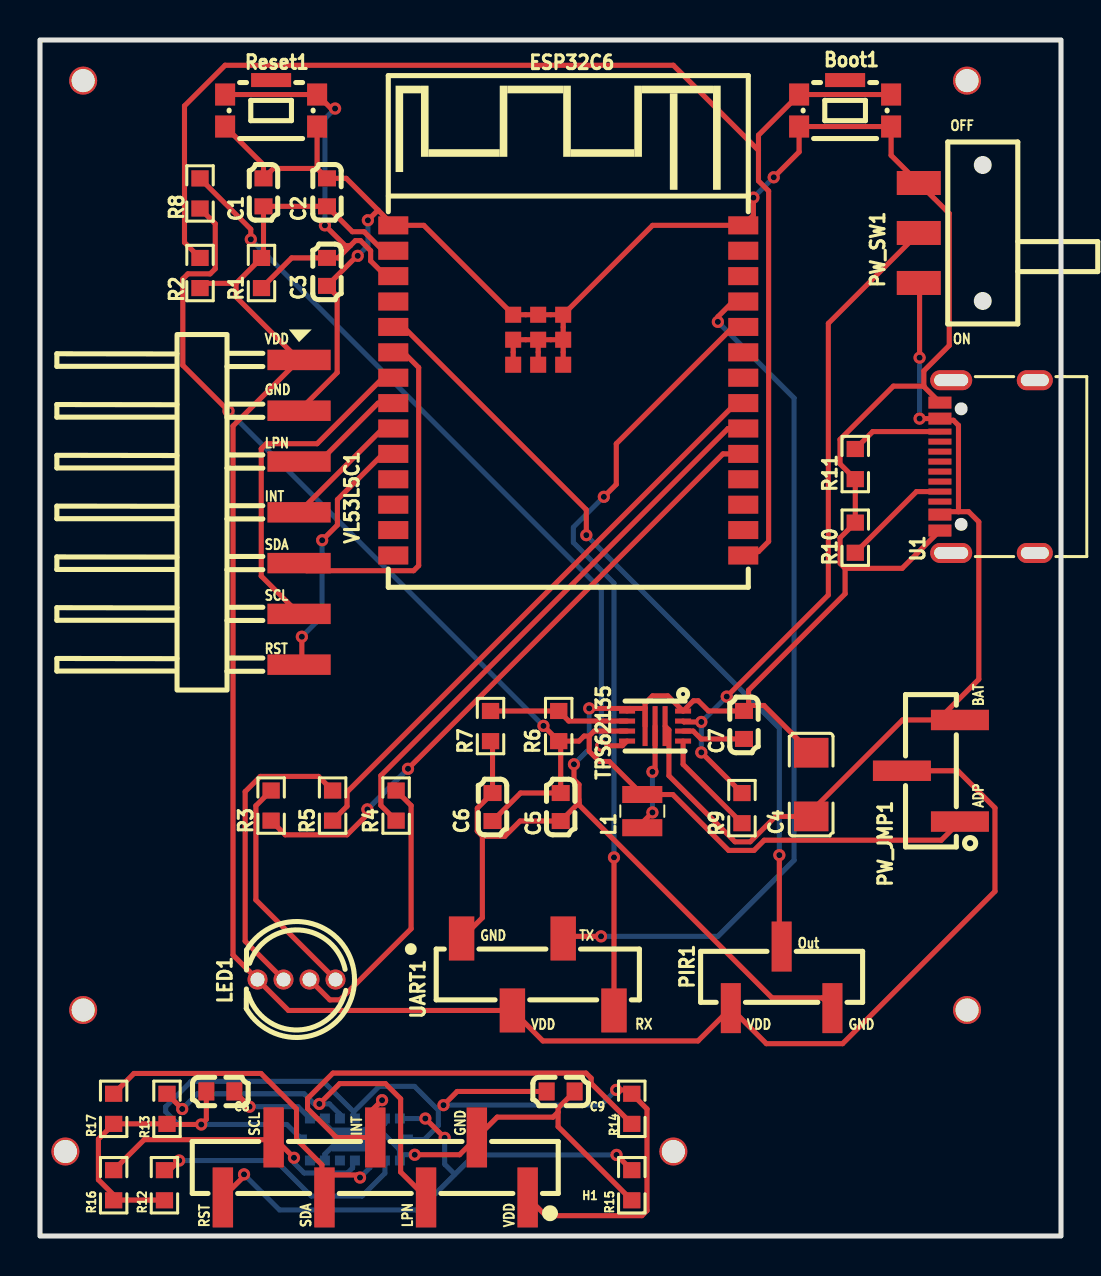
[diagram p4: board, top side]
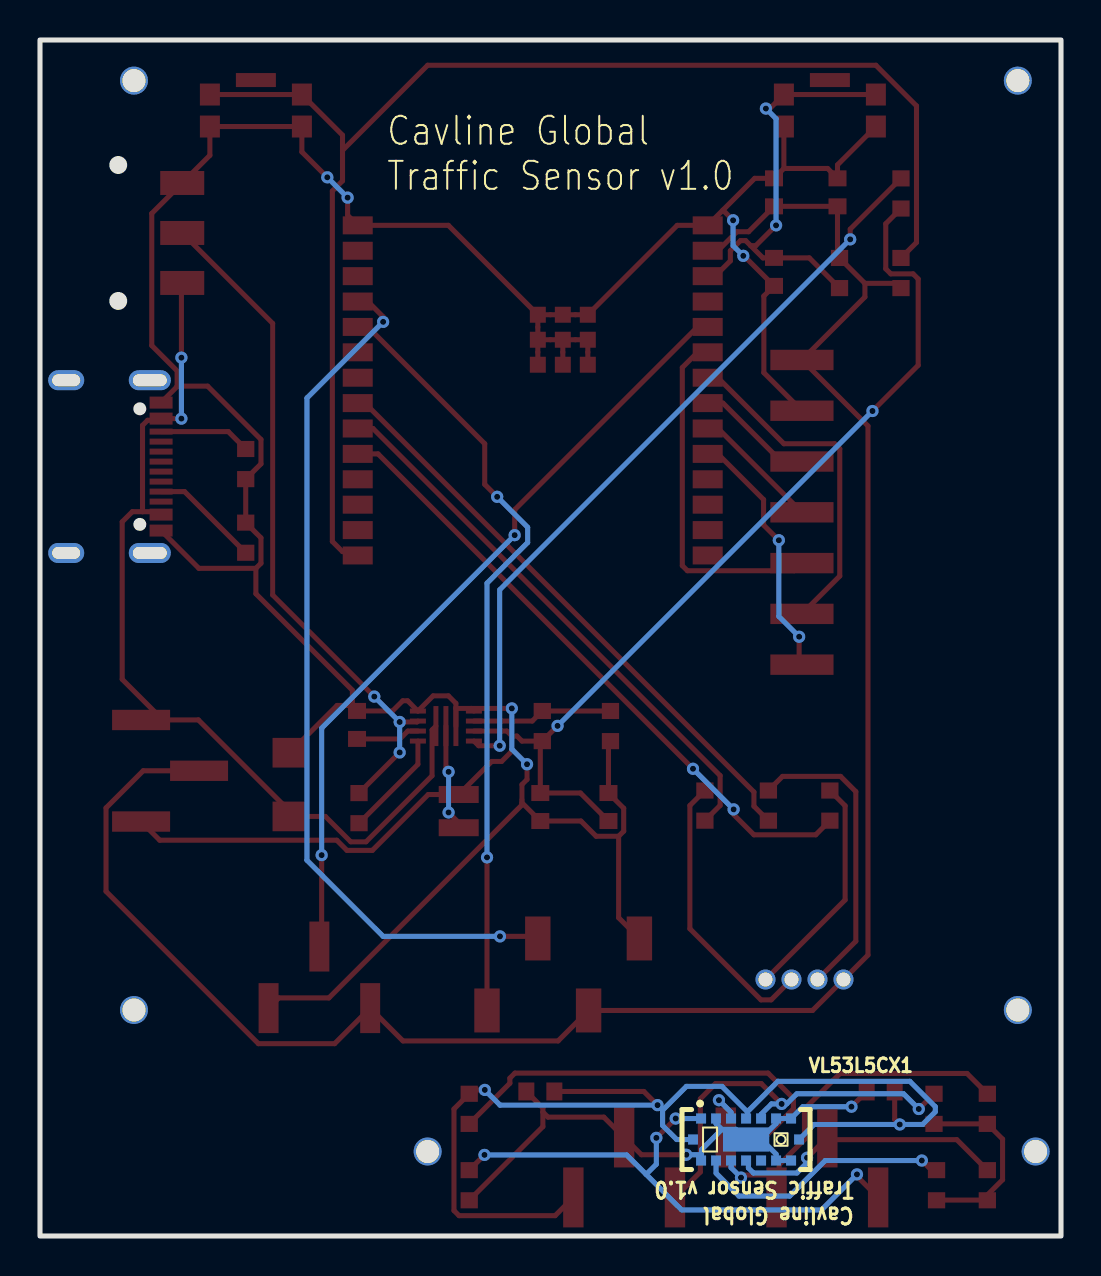
[diagram p5: board, bottom side, seen from below]

Outline 51.05 x 59.82 mm; copper layers: Top Layer, Bottom Layer. Coordinates in mm from the lower left corner of the outline.
Outline path: rectangle 0,59.82 51.05,0
Stack: Top Layer 0.035mm / Dielectric1 1.51mm FR4 er 4.5 / Bottom Layer 0.035mm

## Design rules (mm)
template: JLCPCB Capability(Two Layers Board)
spacing copperThickness1oz (default): track to track 0.102, other pairs 0.152 to 0.3
spacing copperThickness2oz: track to track 0.203, other pairs 0.152 to 0.3
track width copperThickness1oz (default): min 0.127, default 0.254, max 2.54
track width copperThickness2oz: min 0.203, default 0.254, max 2.54
differential pair differentialPair (default): width min 0.127, default 0.254, max 2.54; gap min 0.152, default 0.152
via viaSize (default): diameter min 0.5, default 0.61, max 10; hole min 0.3, default 0.305, max 6.3

## Placement (name value [footprint] x y rotation side)
Boot1  KMR221GLFS  [KEY-SMD_KMR2XXGXXX]  40.26 56.65 0 top
C1  100nF  [C0603]  11.18 52.2 90 top
C2  10uF  [C0603]  14.35 52.2 90 top
C3  1uF  [C0603]  14.35 48.22 90 top
C4  47uF  [C1206]  38.56 22.58 270 top
C5  22uF  [C0603]  26.04 21.46 90 top
C6  22uF  [C0603]  22.63 21.46 270 top
C7  3.3nF  [C0603]  35.2 25.56 90 top
C8  100nF  [C0603]  9.02 7.23 180 top
C9  4.7uF  [C0603]  26.03 7.23 180 top
ESP32C6  ESP32-C6-WROOM-1-N8  [WIRELM-SMD_ESP32-C6-WROOM-1]  26.42 42.29 0 top
H1  HX PM2.54-1x7P TP-YQ  [HDR-SMD_7P-P2.54_HX-PM2.54-1X7P-TP-YQ]  16.76 3.43 180 top
L1  1uH  [IND-SMD_L2.5-W2.0-VLS252012CX-150M]  30.12 21.25 90 top
LED1  TJ-L5FPTXHMCYLCRGB-A5  [LED-TH_4P-BD5.8-P1.30]  12.83 12.83 180 top
NOREF  -  [Pad_e330]  46.35 11.3 0 top
NOREF#2  -  [Pad_e331]  2.16 11.3 0 top
NOREF#3  -  [Pad_e328]  46.35 57.79 0 top
NOREF#4  -  [Pad_e1242]  31.67 4.23 90 top
NOREF#5  -  [Pad_e1241]  1.27 4.23 90 top
NOREF#6  -  [Pad_e329]  2.16 57.79 0 top
PIR1  HX PM2.54-1x3P TP-YQ  [HDR-SMD_3P-P2.54-V-F_C9900045551]  37.08 12.94 0 top
PW_JMP1  DZ254S-11-03-48  [HDR-TH_3P-P2.54_DZ254S-11-03-48]  44.55 23.27 90 top
PW_SW1  MST-12D18G4 SPDT Slide Switch  [SW-SMD_MST-12D18G4-SPDT-SLIDE-SWITCH]  43.94 50.17 90 top
R1  10kΩ  [R0603]  11.08 48.16 90 top
R2  10kΩ  [R0603]  8 48.16 270 top
R3  470Ω  [R0603]  11.56 21.53 90 top
R4  470Ω  [R0603]  17.81 21.53 90 top
R5  470Ω  [R0603]  14.63 21.53 90 top
R6  560kΩ  [R0603]  25.94 25.5 270 top
R7  150kΩ  [R0603]  22.53 25.5 90 top
R8  100kΩ  [R0603]  8 52.14 270 top
R9  100kΩ  [R0603]  35.1 21.4 90 top
R10  5.1kΩ  [R0603]  40.77 34.93 90 top
R11  5.1kΩ  [R0603]  40.77 38.61 90 top
R12  47kΩ  [R0603]  6.22 2.54 90 top
R13  47kΩ  [R0603]  6.35 6.36 90 top
R14  47kΩ  [R0603]  29.59 6.36 270 top
R15  47kΩ  [R0603]  29.59 2.54 90 top
R16  2.2kΩ  [R0603]  3.68 2.54 90 top
R17  2.2kΩ  [R0603]  3.68 6.36 90 top
Reset1  KMR221GLFS  [KEY-SMD_KMR2XXGXXX]  11.56 56.65 0 top
TPS62135  TPS62135RGXR  [VQFN-HR-11_L3.0-W2.0-P0.50_TPS62135RGXR]  30.76 25.5 90 top
U1  TYPE C-ZL-105PWB  [TYPE-C-SMD_HDGC_TYPE-C-ZL-105PWB]  47.37 38.48 90 top
UART1  HX PM2.54-1x4P TP-YQ  [HDR-SMD_HX-PM2.54-1X4P-TP-YQ]  24.89 13.08 0 top
VL53L5C1  X6511WRS-07H-C60D48  [HDR-SMD_7P-P2.54-H-M-W13.3-N]  12.95 36.2 270 top
VL53L5CX1  VL53L5CXV0GC/1  [LGA-16_L6.4-W3.0_VL53L5CXV0GC-1]  15.75 4.83 0 bottom

## Footprints (pads in the part's own frame, mm; a bottom-side part is the same pattern mirrored in y, then rotated)
C0603
  rect 0.8x0.9 smd: 1(-0.7,0) 2(0.7,0)
C1206
  rect 1.485x1.728 smd: 1(-1.593,0) 2(1.593,0)
HDR-SMD_3P-P2.54-V-F_C9900045551
  rect 1x2.5 smd: 1(-2.54,-1.54) 2(0,1.54) 3(2.54,-1.54)
HDR-SMD_7P-P2.54-H-M-W13.3-N
  rect 1.02x3.16 smd: 1(-7.62,0) 2(-5.08,0) 3(-2.54,0) 4(0,0) 5(2.54,0) 6(5.08,0) 7(7.62,0)
HDR-SMD_7P-P2.54_HX-PM2.54-1X7P-TP-YQ
  rect 1.02x3 smd: 1(-7.62,1.5) 2(-5.08,-1.5) 3(-2.54,1.5) 4(0,-1.5) 5(2.54,1.5) 6(5.08,-1.5) 7(7.62,1.5)
HDR-SMD_HX-PM2.54-1X4P-TP-YQ
  rect 1.27x2.2 smd: 1(-3.81,1.8) 2(-1.27,-1.8) 3(1.27,1.8) 4(3.81,-1.8)
HDR-TH_3P-P2.54_DZ254S-11-03-48
  rect 1.02x2.9 smd: 1(-2.54,-1.45) 2(0,1.45) 3(2.54,-1.45)
IND-SMD_L2.5-W2.0-VLS252012CX-150M
  rect 0.85x2 smd: 1(-0.83,0) 2(0.83,0)
KEY-SMD_KMR2XXGXXX
  rect 1x1.1 smd: 1(-2.3,0.438) 2(2.3,0.438) 3(-2.3,-1.162) 4(2.3,-1.162)
  rect 2x0.7 smd: 5(0,1.162)
LED-TH_4P-BD5.8-P1.30
  round 1 hole 0.7: 1(1.95,0) 2(0.65,0) 3(-0.65,0) 4(-1.95,0)
LGA-16_L6.4-W3.0_VL53L5CXV0GC-1
  rect 0.5x0.5 smd: A1(2.25,-1.05) A2(1.5,-1.05) A3(0.75,-1.05) A4(0,-1.05) A5(-0.75,-1.05) A6(-1.5,-1.05) A7(-2.25,-1.05) B1(2.65,0) B7(-2.65,0) C1(2.25,1.05) C2(1.5,1.05) C3(0.75,1.05) C4(0,1.05) C5(-0.75,1.05) C6(-1.5,1.05) C7(-2.25,1.05)
  rect 2.316x1.2 smd: B4(0,0)
Pad_e328
  round 1.4 hole 1.152: 1(0,0)
Pad_e329
  round 1.4 hole 1.152: 2(0,0)
Pad_e330
  round 1.4 hole 1.152: 3(0,0)
Pad_e331
  round 1.4 hole 1.152: 4(0,0)
Pad_e1241
  round 1.4 hole 1.152: 1(0,0)
Pad_e1242
  round 1.4 hole 1.152: 2(0,0)
R0603
  rect 0.806x0.864 smd: 1(-0.753,0) 2(0.753,0)
SW-SMD_MST-12D18G4-SPDT-SLIDE-SWITCH
  rect 1.2x2.2 smd: 1(-2.5,0) 2(0,0) 3(2.5,0)
TYPE-C-SMD_HDGC_TYPE-C-ZL-105PWB
  oval 1x2.1 hole 0.6x1.7: 12(-4.32,1.808) 13(4.32,1.808)
  oval 1x1.8 hole 0.6x1.4: 14(-4.32,-2.373) 15(4.32,-2.373)
  rect 0.6x1.15 smd: A1B12(-3.2,2.373) A4B9(-2.4,2.373) A9B4(2.4,2.373) A12B1(3.2,2.373)
  rect 0.3x1.15 smd: A5(-1.25,2.373) A6(-0.25,2.373) A7(0.25,2.373) A8(1.25,2.373) B5(1.75,2.373) B6(0.75,2.373) B7(-0.75,2.373) B8(-1.75,2.373)
VQFN-HR-11_L3.0-W2.0-P0.50_TPS62135RGXR
  rect 2x0.25 smd: 1(0,-0.5) 2(0,0) 3(0,0.5)
  rect 0.25x0.8 smd: 4(0.75,1.4) 5(0.25,1.4) 6(-0.25,1.4) 7(-0.75,1.4) 8(-0.75,-1.4) 9(-0.25,-1.4) 10(0.25,-1.4) 11(0.75,-1.4)
WIRELM-SMD_ESP32-C6-WROOM-1
  rect 1.5x0.9 smd: 1(-8.75,8.255) 2(-8.75,6.985) 3(-8.75,5.715) 4(-8.75,4.445) 5(-8.75,3.175) 6(-8.75,1.905) 7(-8.75,0.635) 8(-8.75,-0.635) 9(-8.75,-1.905) 10(-8.75,-3.175) 11(-8.75,-4.445) 12(-8.75,-5.715) 13(-8.75,-6.985) 14(-8.75,-8.255) 15(8.75,-8.255) 16(8.75,-6.985) 17(8.75,-5.715) 18(8.75,-4.445) 19(8.75,-3.175) 20(8.75,-1.905) 21(8.75,-0.635) 22(8.75,0.635) 23(8.75,1.905) 24(8.75,3.175) 25(8.75,4.445) 26(8.75,5.715) 27(8.75,6.985) 28(8.75,8.255)
  rect 0.8x0.8 smd: 29(-2.755,3.785) 30(-1.505,3.785) 31(-0.255,3.785) 32(-0.255,2.535) 33(-1.505,2.535) 34(-2.755,2.535) 35(-2.755,1.285) 36(-1.505,1.285) 37(-0.255,1.285)

## Nets
As in the schematic.

Pads without a net: Boot1 5; ESP32C6 22; NOREF 3; NOREF#2 4; NOREF#3 1; NOREF#4 2; NOREF#5 1; NOREF#6 2; Reset1 5; U1 12 13 14 15 A6 A7 A8 B6 B7 B8

## Via types
v1: diameter 0.61, hole 0.305, Top Layer to Bottom Layer, 44 vias

## Routing (per net, layer and track width the routed paths; a pad name or vN(x,y) marks a point on that pad's centre or on a via; arc(x,y) is an arc through that point)
GND: length 190
  Top Layer w0.25: 29.49,26.39 v1(27.46,26.39) ; 29.49,26.39 TPS62135.4 ; 29.49,26.39 30.26,26.39 ; 26.95,21.82 26.95,22.58 26.7,22.83 v1(26.7,23.59) ; C7.2 33.42,26.26 32.92,26.77 32.67,26.77 TPS62135.11 31.39,27.02 30.63,27.02 30.26,26.64 30.26,26.39 ; 30.26,26.39 TPS62135.3 ; 26.95,21.67 C5.1
  Top Layer w0.254: 9.72,7.23 v1(10.48,6.47) ; 16.9,51.31 ESP32C6.1 19.19,50.55 ESP32C6.29 ESP32C6.30 ESP32C6.31 ; 16.9,51.31 15.31,52.9 C2.2 13.86,53.39 ; 16.9,51.31 v1(16.4,50.8) ; 44.2,42.51 44.2,43.27 45.47,44.54 45.47,51.14 PW_SW1.3 42.56,54.05 Boot1.4 37.96,55.49 37.96,54.22 v1(36.69,52.95) ; 44.2,42.51 44.2,42.48 U1.A12B1 ; 44.2,42.51 42.67,42.51 40,39.84 40,38.62 R11.1 R10.2 40,34.92 40,33.65 40.26,33.39 ; v1(15.89,49.02) 15.85,49.02 C3.1 14.86,47.01 14.86,43.18 VL53L5C1.2 ; ESP32C6.31 30.63,50.55 ESP32C6.28 35.67,51.05 v1(35.67,51.93) ; ESP32C6.31 ESP32C6.32 ; 35.43,26.53 36.2,26.53 C4.1 ; 35.43,26.53 C7.2 ; 35.43,26.53 35.43,27.3 40.26,32.12 40.26,33.39 ; 40.26,33.39 43.11,33.39 U1.A1B12 ; 25.91,6.2 25.91,6.4 26.74,7.23 ; 25.91,6.2 25.91,5.47 R15.1 ; 25.91,6.2 25.65,5.94 22.86,5.94 H1.2 20.98,4.06 v1(18.74,4.06) ; 22.12,19.99 21.87,20.25 21.87,21.39 C6.1 22.63,24.65 R7.1 ; 22.12,19.99 22.12,15.92 UART1.1 ; 22.12,19.99 23.24,19.99 24,20.76 C5.1 ; PIR1.3 39.11,11.91 36.61,11.91 26.95,21.56 26.95,21.82 ; ESP32C6.37 ESP32C6.32 ; 13.86,53.39 Reset1.4 ; 13.86,53.39 11.67,53.39 C1.2 11.18,53.57 Reset1.3 ; ESP32C6.32 ESP32C6.33 ; ESP32C6.33 ESP32C6.36 ; ESP32C6.33 ESP32C6.34 ESP32C6.35
  Bottom Layer w0.25: v1(26.7,23.59) 27.46,24.36 v1(27.46,26.39)
  Bottom Layer w0.254: 17.98,4.06 17.98,4.32 16.96,5.33 ; 17.98,4.06 17.98,3.8 18,3.78 ; 17.98,4.06 v1(18.74,4.06) ; v1(10.48,6.47) 12.91,6.47 VL53L5CX1.A7 VL53L5CX1.A6 14.25,5.62 15.01,4.86 ; VL53L5CX1.A2 17.25,5.62 16.96,5.33 ; 16.96,5.33 16.26,5.33 VL53L5CX1.B4 15.71,4.86 15.01,4.86 ; 15.01,4.86 14.25,4.1 14.25,3.78 13.5,3.78 ; v1(16.4,50.8) 16.4,49.53 v1(15.89,49.02) ; v1(36.69,52.95) v1(35.67,51.93)
VDD33: length 171.8
  Top Layer w0.254: H1.1 25.29,1.02 30.1,1.02 30.35,1.27 30.35,6.35 R14.1 29.4,7.31 v1(28.81,7.31) ; R12.1 6.21,1.8 3.68,1.8 ; R2.2 8.24,47.65 9.81,47.65 ; 9.81,47.65 9.81,46.96 VL53L5C1.1 9.65,40.51 9.65,14.05 LED1.1 12.42,11.28 UART1.2 25.15,9.76 32.9,9.76 PIR1.1 36.32,9.62 40.13,9.62 47.75,17.24 47.75,21.41 45.89,23.27 PW_JMP1.2 ; 9.81,47.65 R1.2 11.18,49.02 C1.1 C2.1 15.62,50.23 16.21,50.23 17.16,49.28 ESP32C6.2 ; 3.68,1.8 3.68,2.05 2.92,2.81 2.92,4.85 R17.1 R13.1 6.38,5.58 v1(8.06,5.58) 8.32,5.83 C8.2 ; 3.68,1.8 R16.1 ; v1(20.18,6.55) 20.86,7.23 C9.2
  Bottom Layer w0.254: 15.68,6.21 15.68,5.94 VL53L5CX1.A4 ; 15.68,6.21 16.95,7.48 18.73,7.48 19.92,6.29 ; 15.68,6.21 14.16,7.74 7.56,7.74 6.28,6.47 6.28,6.21 6.92,5.58 v1(8.06,5.58) 12.35,5.58 VL53L5CX1.B7 ; 19.92,6.29 19.92,5.53 19.22,4.83 VL53L5CX1.B1 ; 19.92,6.29 v1(20.18,6.55) 28.05,6.55 v1(28.81,7.31)
BAT+: length 47.3
  Top Layer w0.25: TPS62135.1 31.45,25.31 31.45,23.02 34.75,19.72 35.51,19.72 36.78,20.99 C4.2
  Top Layer w0.254: 46,25.81 43.13,25.81 38.56,21.24 C4.2 ; 44.91,25.81 46.94,27.84 46.94,35.72 46.44,36.23 45.93,36.23 ; v1(43.98,43.93) 43.98,47.62 PW_SW1.1 ; 45.93,36.23 45.14,36.23 U1.A4B9 ; 45.93,36.23 45.93,40.54 45.67,40.8 45.08,40.8 U1.A9B4 v1(43.98,40.88)
  Bottom Layer w0.254: v1(43.98,40.88) v1(43.98,43.93)
BOOT: length 68.8
  Top Layer w0.254: 35.93,54.3 35.93,55.06 37.96,57.09 Boot1.2 ; 35.93,54.3 35.93,52.77 36.44,52.26 36.44,34.74 35.93,34.23 35.36,34.23 ESP32C6.15 ; 35.93,54.3 31.67,58.55 9.26,58.55 7.22,56.52 7.22,49.69 R2.1
EN: length 22.1
  Top Layer w0.254: v1(14.25,50.55) 15.26,49.53 15.52,49.53 ; Reset1.1 Reset1.2 14.56,56.39 v1(14.76,56.39) ; 15.52,49.53 14.91,48.92 C3.2 12.58,48.92 R1.1 ; 15.52,49.53 15.77,49.78 16.03,49.78 16.53,49.28 16.53,48.77 17.3,48.01 ESP32C6.3
  Bottom Layer w0.254: v1(14.76,56.39) 14.25,55.88 v1(14.25,50.55)
INT: length 32.1
  Top Layer w0.254: 16.6,4.93 14.82,4.93 13.38,6.37 13.38,6.88 14.65,8.15 27.31,8.15 27.56,7.89 27.56,7.64 R14.2 ; 16.6,4.93 H1.4 ; 16.6,4.93 16.6,6.28 v1(17.1,6.79) ; VL53L5C1.4 17.15,40.39 ESP32C6.9
  Bottom Layer w0.254: v1(17.1,6.79) 16.5,6.19 VL53L5CX1.A3
LED_1: length 31.9
  Top Layer w0.254: v1(16.37,21.34) 16.37,21.08 15.35,20.07 12.26,20.07 R3.1 ; ESP32C6.19 34.15,39.12 v1(18.4,23.37)
  Bottom Layer w0.254: v1(18.4,23.37) v1(16.37,21.34)
LED_2: length 27.9
  Top Layer w0.254: R4.1 17.04,21.54 17.04,23.03 34.4,40.39 ESP32C6.20
LED_3: length 29.6
  Top Layer w0.254: ESP32C6.21 34.8,41.66 15.35,22.21 15.35,21.5 R5.1
LPN: length 26.1
  Top Layer w0.254: ESP32C6.8 16.9,41.66 14.11,38.86 13.08,38.86 VL53L5C1.3 ; R13.2 v1(7.11,6.35) ; v1(13.97,6.61) 14.99,7.62 17.27,7.62 18.03,6.86 18.03,3.2 H1.3
  Bottom Layer w0.254: v1(7.11,6.35) 7.87,7.11 13.21,7.11 13.72,6.61 14.48,6.61 15,6.09 VL53L5CX1.A5
PIR: length 39.3
  Top Layer w0.254: PIR1.2 36.97,14.59 v1(36.97,19.05) ; v1(27.32,35.05) 27.32,36.32 18.17,45.47 ESP32C6.5
  Bottom Layer w0.254: v1(27.32,35.05) 36.97,25.4 v1(36.97,19.05)
REG_3V3: length 68.3
  Top Layer w0.25: R6.2 26.95,24.75 27.21,25.01 27.46,25.01 ; 27.46,25.01 27.46,24.24 27.97,23.74 28.46,23.74 L1.2 ; 27.46,25.01 27.71,25.26 TPS62135.6
  Top Layer w0.254: R8.2 8.76,50.63 8.76,48.37 8.51,48.12 7.39,48.12 7.14,47.87 7.14,43.55 v1(9.43,41.26) ; PW_JMP1.1 45.07,19.79 36.21,19.79 35.7,19.29 34.43,19.29 31.64,22.08 L1.2 ; C6.2 24.03,22.16 C5.2 26.04,24.65 R6.2 v1(25.18,25.51)
  Bottom Layer w0.254: v1(25.18,25.51) v1(9.43,41.26)
REG_EN: length 34.3
  Top Layer w0.25: v1(33.07,25.71) 32.2,25.71 TPS62135.10 ; PW_SW1.2 39.42,45.64 39.42,32.06 v1(34.34,26.98) ; R9.2 v1(33.07,24.19)
  Bottom Layer w0.25: v1(33.07,24.19) v1(33.07,25.71) v1(34.34,26.98)
RST: length 40.6
  Top Layer w0.254: v1(20.24,4.91) v1(19.27,5.88) ; R15.2 v1(28.83,4.06) ; ESP32C6.10 17.16,39.12 14.87,36.83 14.87,35.56 v1(14.11,34.8) ; H1.7 10.2,2.99 v1(10.2,3.08) ; VL53L5C1.7 13.09,28.72 v1(13.09,29.97)
  Bottom Layer w0.254: 20.74,3.08 18.97,1.3 11.98,1.3 v1(10.2,3.08) ; 20.74,3.08 20.24,3.59 v1(20.24,4.91) ; 20.74,3.08 21.72,4.06 v1(28.83,4.06) ; v1(14.11,34.8) 14.11,30.99 v1(13.09,29.97) ; v1(19.27,5.88) VL53L5CX1.A1
RSVD6: length 13.1
  Top Layer w0.254: R12.2 6.48,3.29 v1(6.96,3.78)
  Bottom Layer w0.254: 17.25,3.78 17.25,3.14 16.1,2 13.56,2 11.79,3.78 v1(6.96,3.78)
RX: length 38.8
  Top Layer w0.254: v1(28.7,18.94) UART1.4 ; v1(28.19,36.97) 28.82,37.59 28.82,39.62 34.66,45.47 ESP32C6.24
  Bottom Layer w0.254: v1(28.7,18.94) 28.7,32.65 26.67,34.68 26.67,35.45 v1(28.19,36.97)
SCL: length 31.2
  Top Layer w0.254: VL53L5C1.6 11.06,33.01 11.06,39.37 11.32,39.62 13.86,39.62 17.16,42.93 17.67,42.93 ; R16.2 5.21,4.82 11.57,4.82 H1.6 v1(12.7,3.91)
  Bottom Layer w0.254: 15.75,3.78 15.63,3.66 15.63,3.41 15.38,3.15 13.21,3.15 12.7,3.66 v1(12.7,3.91)
SDA: length 36.1
  Top Layer w0.254: ESP32C6.6 18.17,44.2 18.94,43.43 18.94,33.53 18.68,33.27 13.34,33.27 VL53L5C1.5 ; 14.1,3.05 15.88,3.05 v1(16,2.92) ; 14.1,3.05 14.1,2.06 H1.5 ; 14.1,3.05 14.1,3.56 12.83,4.83 12.83,6.35 11.05,8.13 4.7,8.13 R17.2
  Bottom Layer w0.254: 16.5,3.78 16.5,3.42 v1(16,2.92)
TX: length 43.5
  Top Layer w0.254: v1(28.05,14.99) 26.27,14.99 UART1.3 ; v1(33.9,45.72) 33.9,45.97 34.66,46.74 ESP32C6.25
  Bottom Layer w0.254: v1(28.05,14.99) 33.9,14.99 37.71,18.8 37.71,41.91 v1(33.9,45.72)
$1N15941: length 5.3
  Top Layer w0.25: TPS62135.2 30.76,23.35 v1(30.62,23.22) ; v1(30.62,21.18) 30.12,20.68 L1.1
  Bottom Layer w0.25: v1(30.62,21.18) v1(30.62,23.22)
$1N15942: length 38.1
  Top Layer w0.25: v1(28.07,24.52) 29.12,24.52 TPS62135.7 ; R8.1 10.54,50.35 v1(10.54,49.85)
  Bottom Layer w0.25: v1(28.07,24.52) 28.07,32.32 v1(10.54,49.85)
$1N15949: length 5.3
  Top Layer w0.25: R9.1 32.16,23.59 TPS62135.8
$1N15952: length 7
  Top Layer w0.25: TPS62135.5 26.44,25.75 R6.1
  Top Layer w0.254: R6.1 R7.2
$1N15959: length 3.2
  Top Layer w0.25: C7.1 33.06,24.86 32.66,25.26 TPS62135.9
$1N15996: length 11.4
  Top Layer w0.254: R3.2 10.79,21.52 10.79,16.81 LED1.4
$1N15997: length 14.2
  Top Layer w0.254: R4.2 18.56,21.53 18.56,15.37 15,11.81 14.49,11.81 LED1.3
$1N15998: length 15.2
  Top Layer w0.254: LED1.2 10.26,14.75 10.26,22.23 11.02,22.99 13.92,22.99 R5.2
$1N16060: length 5.5
  Top Layer w0.254: U1.A5 43.83,37.23 R10.1
$1N16063: length 4.6
  Top Layer w0.254: U1.B5 41.64,40.23 R11.2

## Text on the board
Bottom Silkscreen Layer: Cavline Global / Traffic Sensor v1.0
Top Silkscreen Layer: VDD | GND | LPN | INT | SDA | SCL | RST | TX | Out | OFF | ON | BAT | ADP | RX
